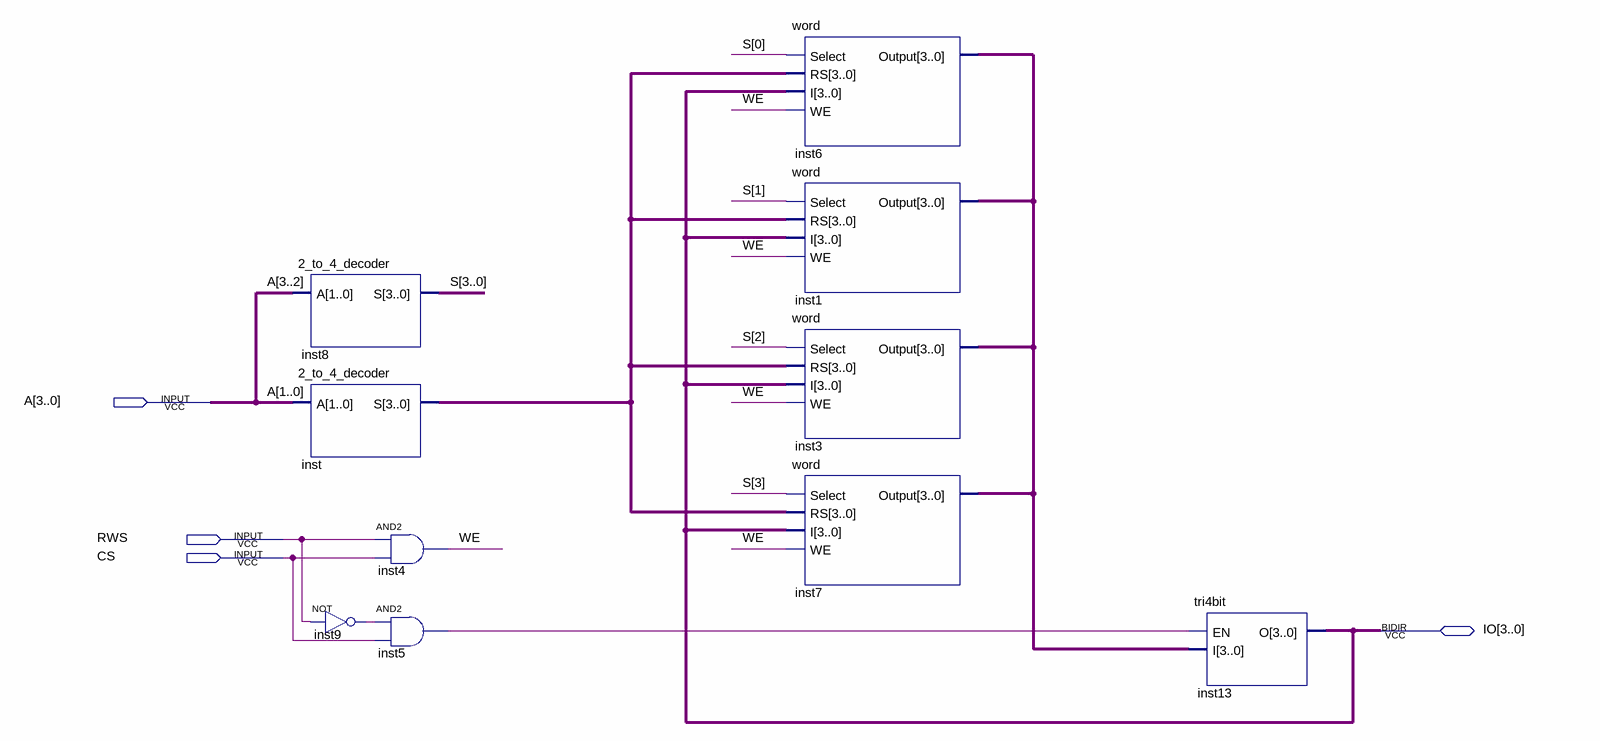
[diagram p0: schematic sheet]
// Quartus schematic ram_4x4.bdf as structural Verilog: 10 symbols, 4 pins
module ram_4x4 (
  input  [3:0] A,
  input  RWS,
  input  CS,
  inout  [3:0] IO
);

  wire inst5_out, inst9_out, WE;
  wire [3:0] inst6_output, inst_s, S;

  \2_to_4_decoder  inst8 (.A(A[3:2]), .S(S));
  \2_to_4_decoder  inst (.A(A[1:0]), .S(inst_s));
  not inst9 (inst9_out, RWS);
  and inst4 (WE, RWS, CS);
  and inst5 (inst5_out, inst9_out, CS);
  word inst6 (.Select(S[0]), .RS(inst_s), .I(IO), .WE(WE), .Output(inst6_output));
  word inst1 (.Select(S[1]), .RS(inst_s), .I(IO), .WE(WE), .Output(inst6_output));
  word inst3 (.Select(S[2]), .RS(inst_s), .I(IO), .WE(WE), .Output(inst6_output));
  word inst7 (.Select(S[3]), .RS(inst_s), .I(IO), .WE(WE), .Output(inst6_output));
  tri4bit inst13 (.EN(inst5_out), .I(inst6_output), .O(IO));
endmodule
